# EAGLE design Breakout_v1 (EAGLE 7.5.0)
CNAME: EARS PocketQube Breakout Board; CREVISION: 1.0; DESIGNER: L. Stant
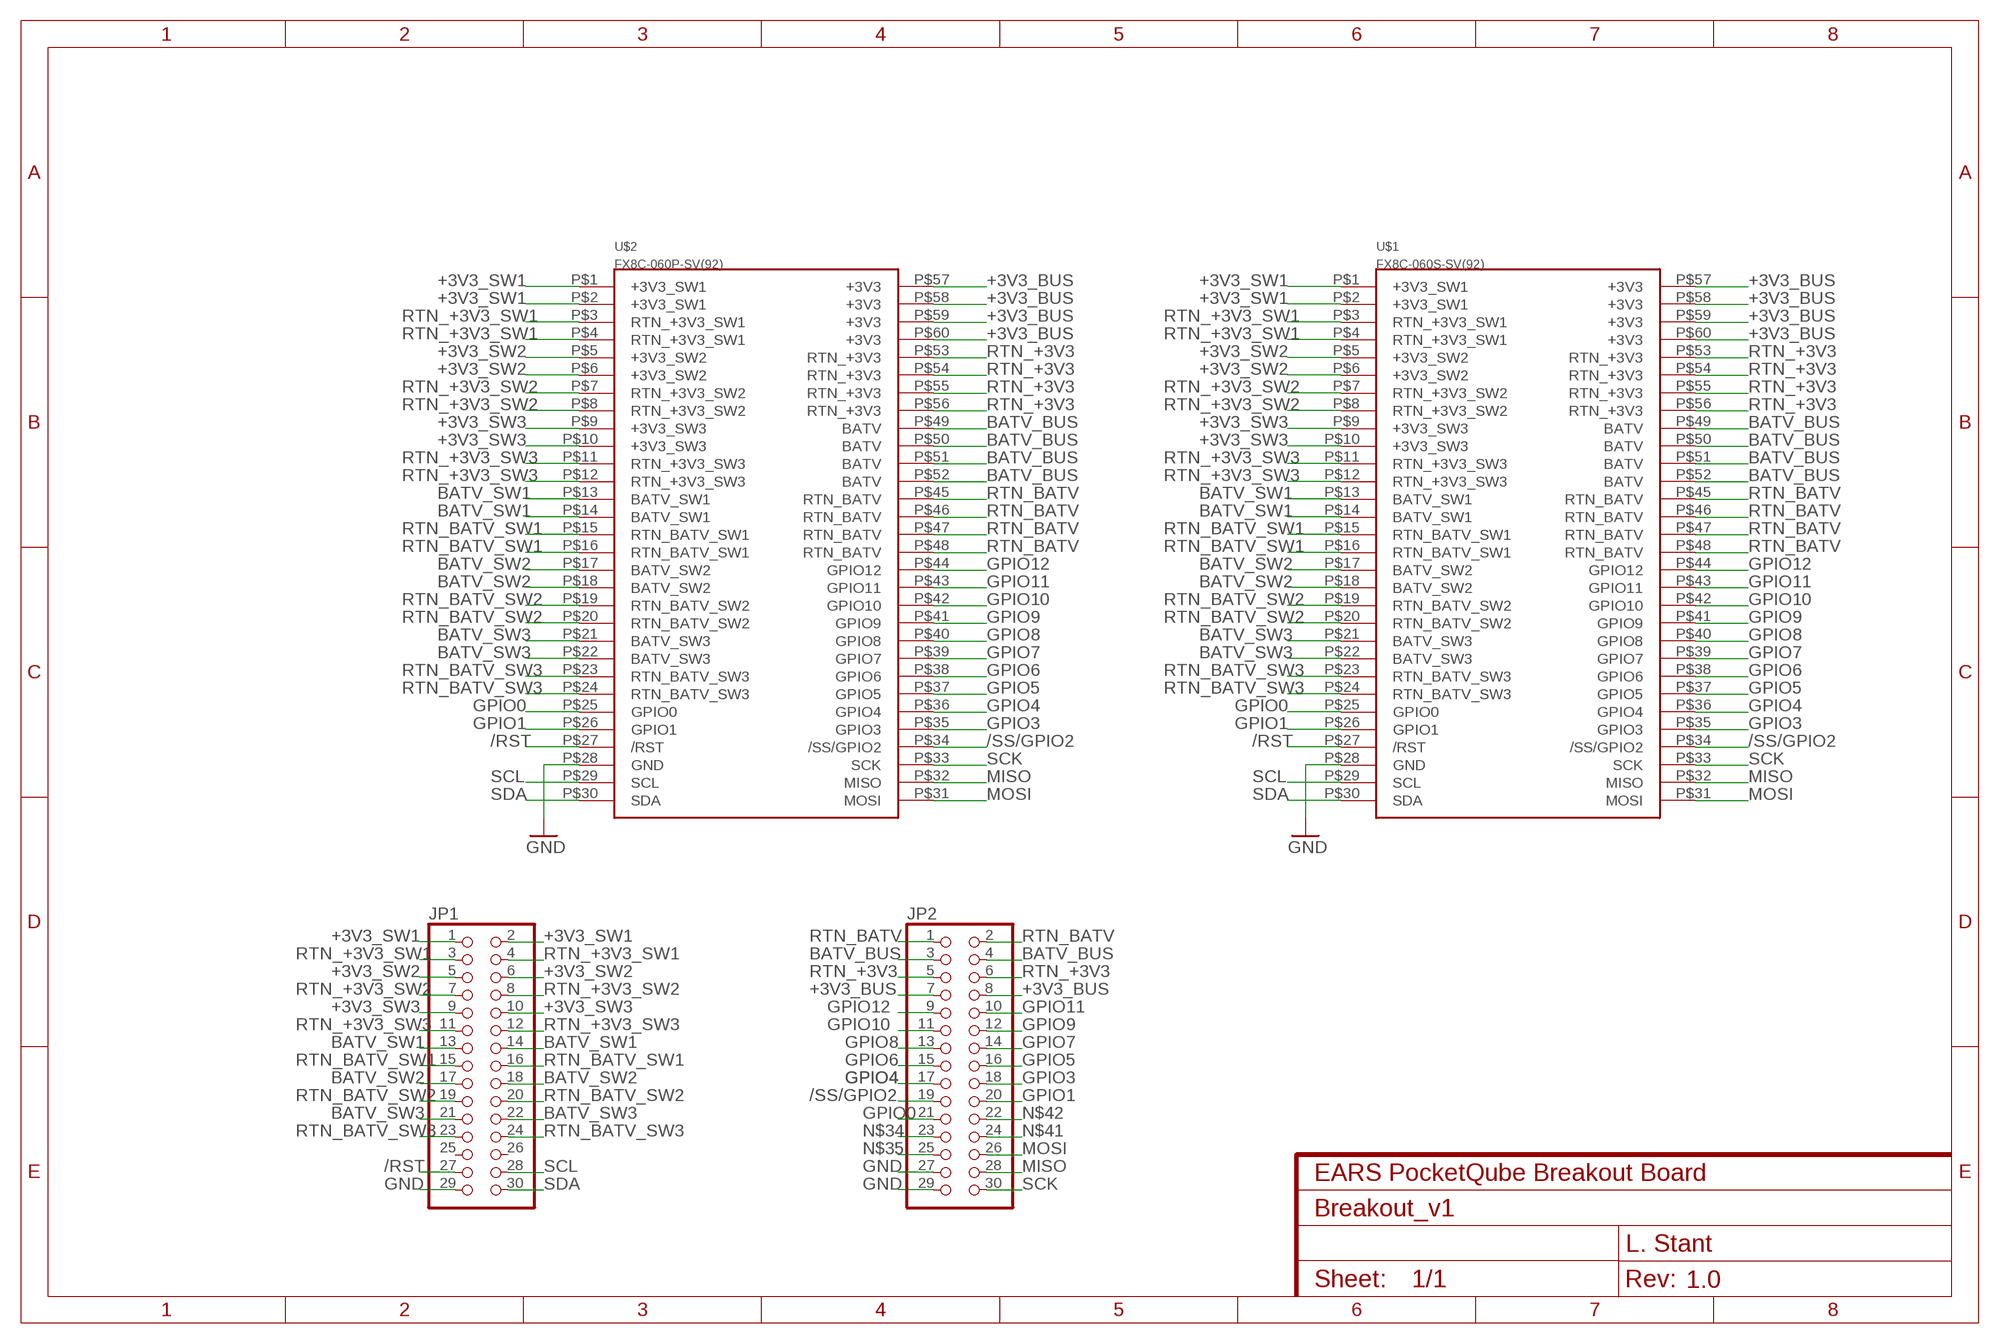
[diagram p0: schematic, sheet 1]

## Parts
JP1  PINHD-2X15  [2X15]
JP2  PINHD-2X15  [2X15]
U$1  FX8C-060S-SV(92)  [FX8C-060S-SV(92)]
U$2  FX8C-060P-SV(92)  [FX8C-060P-SV(92)]

## Nets
+3V3_BUS: JP2.7 JP2.8 U$1.P$57(+3V3) U$1.P$58(+3V3) U$1.P$59(+3V3) U$1.P$60(+3V3) U$2.P$57(+3V3) U$2.P$58(+3V3) U$2.P$59(+3V3) U$2.P$60(+3V3)
+3V3_SW1: JP1.1 JP1.2 U$1.P$1(+3V3_SW1) U$1.P$2(+3V3_SW1) U$2.P$1(+3V3_SW1) U$2.P$2(+3V3_SW1)
+3V3_SW2: JP1.5 JP1.6 U$1.P$5(+3V3_SW2) U$1.P$6(+3V3_SW2) U$2.P$5(+3V3_SW2) U$2.P$6(+3V3_SW2)
+3V3_SW3: JP1.9 JP1.10 U$1.P$9(+3V3_SW3) U$1.P$10(+3V3_SW3) U$2.P$9(+3V3_SW3) U$2.P$10(+3V3_SW3)
/RST: JP1.27 U$1.P$27(/RST) U$2.P$27(/RST)
/SS/GPIO2: JP2.19 U$1.P$34(/SS/GPIO2) U$2.P$34(/SS/GPIO2)
BATV_BUS: JP2.3 JP2.4 U$1.P$49(BATV) U$1.P$50(BATV) U$1.P$51(BATV) U$1.P$52(BATV) U$2.P$49(BATV) U$2.P$50(BATV) U$2.P$51(BATV) U$2.P$52(BATV)
BATV_SW1: JP1.13 JP1.14 U$1.P$13(BATV_SW1) U$1.P$14(BATV_SW1) U$2.P$13(BATV_SW1) U$2.P$14(BATV_SW1)
BATV_SW2: JP1.17 JP1.18 U$1.P$17(BATV_SW2) U$1.P$18(BATV_SW2) U$2.P$17(BATV_SW2) U$2.P$18(BATV_SW2)
BATV_SW3: JP1.21 JP1.22 U$1.P$21(BATV_SW3) U$1.P$22(BATV_SW3) U$2.P$21(BATV_SW3) U$2.P$22(BATV_SW3)
GND: JP1.29 JP2.27 JP2.29 U$1.P$28(GND) U$2.P$28(GND)
GPIO0: JP2.21 U$1.P$25(GPIO0) U$2.P$25(GPIO0)
GPIO1: JP2.20 U$1.P$26(GPIO1) U$2.P$26(GPIO1)
GPIO3: JP2.18 U$1.P$35(GPIO3) U$2.P$35(GPIO3)
GPIO4: JP2.17 U$1.P$36(GPIO4) U$2.P$36(GPIO4)
GPIO5: JP2.16 U$1.P$37(GPIO5) U$2.P$37(GPIO5)
GPIO6: JP2.15 U$1.P$38(GPIO6) U$2.P$38(GPIO6)
GPIO7: JP2.14 U$1.P$39(GPIO7) U$2.P$39(GPIO7)
GPIO8: JP2.13 U$1.P$40(GPIO8) U$2.P$40(GPIO8)
GPIO9: JP2.12 U$1.P$41(GPIO9) U$2.P$41(GPIO9)
GPIO10: JP2.11 U$1.P$42(GPIO10) U$2.P$42(GPIO10)
GPIO11: JP2.10 U$1.P$43(GPIO11) U$2.P$43(GPIO11)
GPIO12: JP2.9 U$1.P$44(GPIO12) U$2.P$44(GPIO12)
MISO: JP2.28 U$1.P$32(MISO) U$2.P$32(MISO)
MOSI: JP2.26 U$1.P$31(MOSI) U$2.P$31(MOSI)
N$34: JP2.23
N$35: JP2.25
N$41: JP2.24
N$42: JP2.22
RTN_+3V3: JP2.5 JP2.6 U$1.P$53(RTN_+3V3) U$1.P$54(RTN_+3V3) U$1.P$55(RTN_+3V3) U$1.P$56(RTN_+3V3) U$2.P$53(RTN_+3V3) U$2.P$54(RTN_+3V3) U$2.P$55(RTN_+3V3) U$2.P$56(RTN_+3V3)
RTN_+3V3_SW1: JP1.3 JP1.4 U$1.P$3(RTN_+3V3_SW1) U$1.P$4(RTN_+3V3_SW1) U$2.P$3(RTN_+3V3_SW1) U$2.P$4(RTN_+3V3_SW1)
RTN_+3V3_SW2: JP1.7 JP1.8 U$1.P$7(RTN_+3V3_SW2) U$1.P$8(RTN_+3V3_SW2) U$2.P$7(RTN_+3V3_SW2) U$2.P$8(RTN_+3V3_SW2)
RTN_+3V3_SW3: JP1.11 JP1.12 U$1.P$11(RTN_+3V3_SW3) U$1.P$12(RTN_+3V3_SW3) U$2.P$11(RTN_+3V3_SW3) U$2.P$12(RTN_+3V3_SW3)
RTN_BATV: JP2.1 JP2.2 U$1.P$45(RTN_BATV) U$1.P$46(RTN_BATV) U$1.P$47(RTN_BATV) U$1.P$48(RTN_BATV) U$2.P$45(RTN_BATV) U$2.P$46(RTN_BATV) U$2.P$47(RTN_BATV) U$2.P$48(RTN_BATV)
RTN_BATV_SW1: JP1.15 JP1.16 U$1.P$15(RTN_BATV_SW1) U$1.P$16(RTN_BATV_SW1) U$2.P$15(RTN_BATV_SW1) U$2.P$16(RTN_BATV_SW1)
RTN_BATV_SW2: JP1.19 JP1.20 U$1.P$19(RTN_BATV_SW2) U$1.P$20(RTN_BATV_SW2) U$2.P$19(RTN_BATV_SW2) U$2.P$20(RTN_BATV_SW2)
RTN_BATV_SW3: JP1.23 JP1.24 U$1.P$23(RTN_BATV_SW3) U$1.P$24(RTN_BATV_SW3) U$2.P$23(RTN_BATV_SW3) U$2.P$24(RTN_BATV_SW3)
SCK: JP2.30 U$1.P$33(SCK) U$2.P$33(SCK)
SCL: JP1.28 U$1.P$29(SCL) U$2.P$29(SCL)
SDA: JP1.30 U$1.P$30(SDA) U$2.P$30(SDA)
Unconnected: JP1.25 JP1.26

## Library data of the parts
JP1 JP2 = pinhead:PINHD-2X15: PIN HEADER
U$1 = Template:FX8C-060S-SV(92)
U$2 = Template:FX8C-060P-SV(92)

## Board
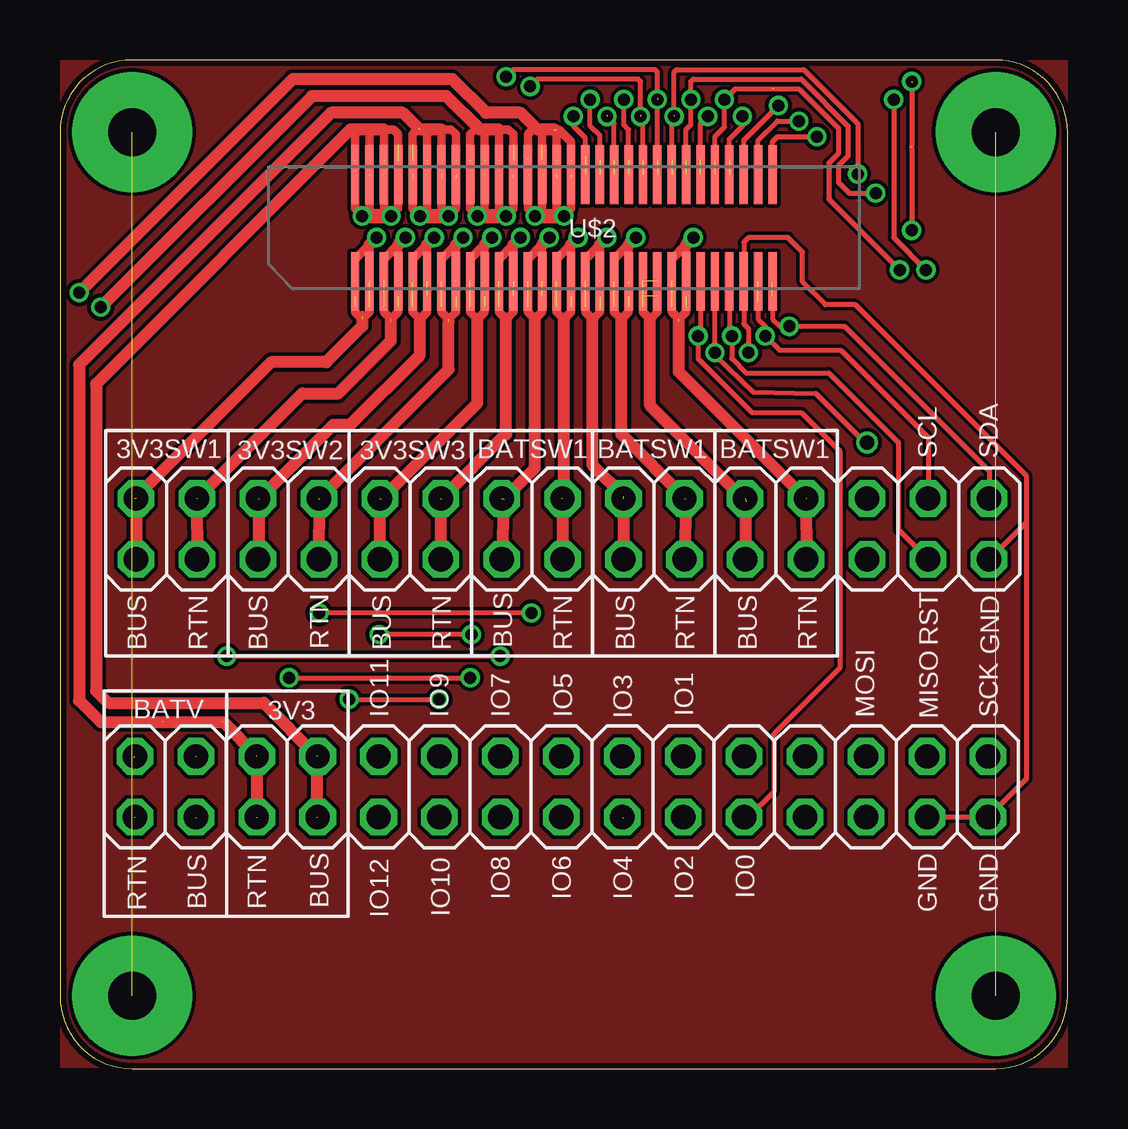
[diagram p1: board, top side]
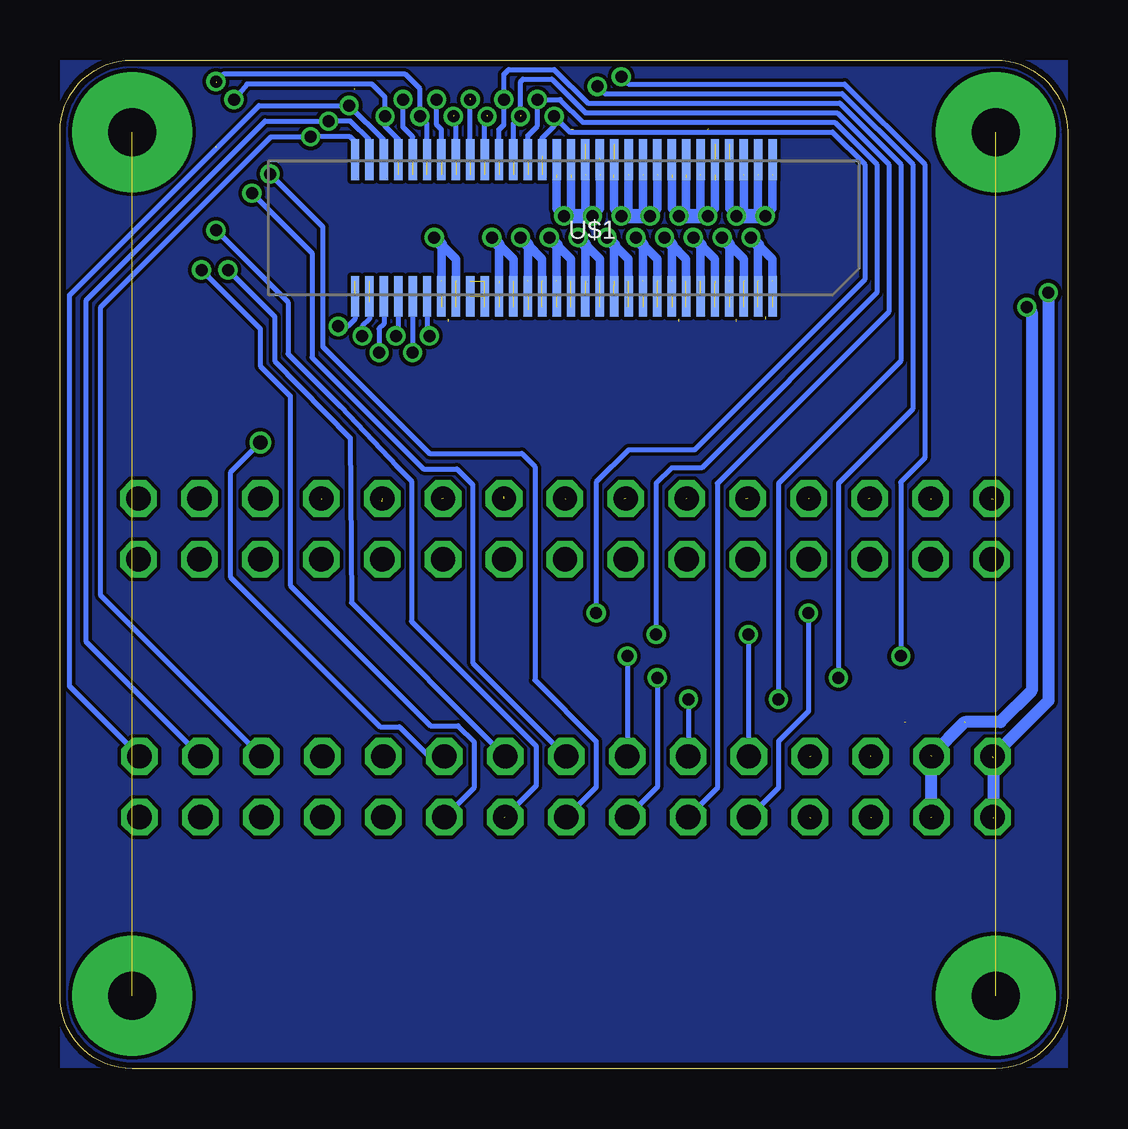
[diagram p2: board, bottom side, seen from below]

Size 42 x 42.05 mm. Coordinates in mm from the lower left corner, seen from the top.
Outline: 3,0 39,0 arc90 42,3.05 42,39.05 arc90 39,42.05 3,42.05 arc90 0,39.05 0,3.05 arc90 3,0
Copper layers (1*16): Top 0.035mm / dielectric 1.5mm / Bottom 0.035mm
Design rules "SeeedStudio_2layer_DRU_no_angle_20140221 *": minimum track width 6mil, minimum drill 0.5mm, track to track 6mil, track to pad 6mil, pad to pad 6mil, via to via 6mil, smd to smd 0mil, copper to edge 10mil, drill to drill 10mil, minimum pad ring 10mil, minimum via ring 6mil, stop-mask expansion 2mil, vias tented up to drill 100mil, thermal gap 10mil

### Footprints (pad centres in the part's own frame; a part is rotated, then mirrored left to right if it is on the bottom)
2X15 = drill 1.016 octagon: 1 -17.78,-1.27; 2 -17.78,1.27; 3 -15.24,-1.27; 4 -15.24,1.27; 5 -12.7,-1.27; 6 -12.7,1.27; 7 -10.16,-1.27; 8 -10.16,1.27; 9 -7.62,-1.27; 10 -7.62,1.27; 11 -5.08,-1.27; 12 -5.08,1.27; 13 -2.54,-1.27; 14 -2.54,1.27; 15 0,-1.27; 16 0,1.27; 17 2.54,-1.27; 18 2.54,1.27; 19 5.08,-1.27; 20 5.08,1.27; 21 7.62,-1.27; 22 7.62,1.27; 23 10.16,-1.27; 24 10.16,1.27; 25 12.7,-1.27; 26 12.7,1.27; 27 15.24,-1.27; 28 15.24,1.27; 29 17.78,-1.27; 30 17.78,1.27
FX8C-060S-SV(92) = smd 0.35 x 1.7: P$1 -8.7,2.85; P$2 -8.1,2.85; P$3 -7.5,2.85; P$4 -6.9,2.85; P$5 -6.3,2.85; P$6 -5.7,2.85; P$7 -5.1,2.85; P$8 -4.5,2.85; P$9 -3.9,2.85; P$10 -3.3,2.85; P$11 -2.7,2.85; P$12 -2.1,2.85; P$13 -1.5,2.85; P$14 -0.9,2.85; P$15 -0.3,2.85; P$16 0.3,2.85; P$17 0.9,2.85; P$18 1.5,2.85; P$19 2.1,2.85; P$20 2.7,2.85; P$21 3.3,2.85; P$22 3.9,2.85; P$23 4.5,2.85; P$24 5.1,2.85; P$25 5.7,2.85; P$26 6.3,2.85; P$27 6.9,2.85; P$28 7.5,2.85; P$29 8.1,2.85; P$30 8.7,2.85; P$31 8.7,-2.85; P$32 8.1,-2.85; P$33 7.5,-2.85; P$34 6.9,-2.85; P$35 6.3,-2.85; P$36 5.7,-2.85; P$37 5.1,-2.85; P$38 4.5,-2.85; P$39 3.9,-2.85; P$40 3.3,-2.85; P$41 2.7,-2.85; P$42 2.1,-2.85; P$43 1.5,-2.85; P$44 0.9,-2.85; P$45 0.3,-2.85; P$46 -0.3,-2.85; P$47 -0.9,-2.85; P$48 -1.5,-2.85; P$49 -2.1,-2.85; P$50 -2.7,-2.85; P$51 -3.3,-2.85; P$52 -3.9,-2.85; P$53 -4.5,-2.85; P$54 -5.1,-2.85; P$55 -5.7,-2.85; P$56 -6.3,-2.85; P$57 -6.9,-2.85; P$58 -7.5,-2.85; P$59 -8.1,-2.85; P$60 -8.7,-2.85
FX8C-060P-SV(92) = smd 0.35 x 2.45: P$1 -8.7,-2.225; P$2 -8.1,-2.225; P$3 -7.5,-2.225; P$4 -6.9,-2.225; P$5 -6.3,-2.225; P$6 -5.7,-2.225; P$7 -5.1,-2.225; P$8 -4.5,-2.225; P$9 -3.9,-2.225; P$10 -3.3,-2.225; P$11 -2.7,-2.225; P$12 -2.1,-2.225; P$13 -1.5,-2.225; P$14 -0.9,-2.225; P$15 -0.3,-2.225; P$16 0.3,-2.225; P$17 0.9,-2.225; P$18 1.5,-2.225; P$19 2.1,-2.225; P$20 2.7,-2.225; P$21 3.3,-2.225; P$22 3.9,-2.225; P$23 4.5,-2.225; P$24 5.1,-2.225; P$25 5.7,-2.225; P$26 6.3,-2.225; P$27 6.9,-2.225; P$28 7.5,-2.225; P$29 8.1,-2.225; P$30 8.7,-2.225; P$31 8.7,2.225; P$32 8.1,2.225; P$33 7.5,2.225; P$34 6.9,2.225; P$35 6.3,2.225; P$36 5.7,2.225; P$37 5.1,2.225; P$38 4.5,2.225; P$39 3.9,2.225; P$40 3.3,2.225; P$41 2.7,2.225; P$42 2.1,2.225; P$43 1.5,2.225; P$44 0.9,2.225; P$45 0.3,2.225; P$46 -0.3,2.225; P$47 -0.9,2.225; P$48 -1.5,2.225; P$49 -2.1,2.225; P$50 -2.7,2.225; P$51 -3.3,2.225; P$52 -3.9,2.225; P$53 -4.5,2.225; P$54 -5.1,2.225; P$55 -5.7,2.225; P$56 -6.3,2.225; P$57 -6.9,2.225; P$58 -7.5,2.225; P$59 -8.1,2.225; P$60 -8.7,2.225

### Placement (x,y rotation side)
JP1  20.95,22.5 0 top
JP2  20.9,11.75 0 top
U$1  21,35.05 180 bottom
U$2  21,35.05 0 top

### Tracks (layer width: path | path; a pad name or v marks a point on that pad's centre or on a via)
+3V3_BUS  (via drill 0.5)  (10 unrouted)
  Top 0.35: U$2.P$57 14.1,35.85 v13.8,35.55 13.5,35.85 13.5,37.25 | 12.9,37.25 12.9,35.85 v12.6,35.55 12.3,35.85 12.3,37.25 | 14.1,38.55 14.1,38.95 13.9,39.15 13.5,39.15 13.5,38.55 | 12.4,39.15 12.3,38.95 12.3,38.55 | 12.9,38.55 12.9,39.15
  Top 0.5: 13.5,39.15 12.9,39.15 12.4,39.15 12.1,39.15 1.5,28.55 1.5,15.75 2,15.25 8.5,15.25 10.7,13.05 10.7,10.45
  Top 0.6: v12.6,35.55 v13.8,35.55
  Bottom 0.35: 12.3,37.85 12.3,35.85 v12.6,35.55 12.9,35.85 12.9,37.85 | 13.5,37.85 13.5,35.85 v13.8,35.55 14.1,35.85 14.1,37.85
  Bottom 0.6: v12.6,35.55 v13.8,35.55
+3V3_SW1  (via drill 0.5)  (7 unrouted)
  Top 0.35: 12.9,33.85 12.9,34.35 12.3,33.75 12.3,32.85 | 12.9,31.75 12.9,31.55 12.6,31.25 12.3,31.55 12.3,31.75
  Top 0.5: 12.9,34.35 v13.2,34.65 | 12.6,31.35 12.6,30.95 11.1,29.45 8.8,29.45 3.1,23.75 | JP1.2 JP1.1
  Bottom 0.35: 12.9,32.85 12.9,34.35 12.3,33.75 12.3,32.85
  Bottom 0.5: 12.9,34.35 v13.2,34.65
+3V3_SW2  (via drill 0.5)  (6 unrouted)
  Top 0.35: 15.3,33.85 15.3,34.35 14.7,33.75 | 15.3,31.65 15.3,31.55 15,31.25 14.7,31.55 14.7,31.75
  Top 0.5: 15.3,34.35 v15.6,34.65 | 15,31.25 15,29.75 12.1,26.85 11.4,26.85 8.3,23.75 JP1.5
  Bottom 0.35: 15.3,32.75 15.3,34.35 14.7,33.75 14.7,32.75
  Bottom 0.5: v15.6,34.65 15.3,34.35
+3V3_SW3  (via drill 0.5)  (6 unrouted)
  Top 0.35: 17.7,33.85 17.7,34.35 17.1,33.75 | 17.7,31.75 17.7,31.55 17.4,31.25 17.1,31.55 17.1,31.75
  Top 0.5: 17.7,34.35 v18,34.65 | 13.4,23.75 17.4,27.75 17.4,31.25 | JP1.10 JP1.9
  Bottom 0.35: 17.7,32.85 17.7,34.35 17.1,33.75 17.1,32.85
  Bottom 0.5: v18,34.65 17.7,34.35
/RST  (via drill 0.5)
  Top 0.2: U$2.P$27 27.9,30.65 v28,30.55 28,29.6 28.6,29 32.05,29 34.95,26.1 34.95,22.47 JP1.27
  Bottom 0.2: U$1.P$27 27.9,30.65 v28,30.55
/SS/GPIO2  (via drill 0.5)  (1 unrouted)
  Top 0.2: 27.9,38.25 27.9,38.75 28.45,39.3 v28.45,39.7 | v34.75,40.4 34.75,34.65 v36.1,33.3
  Bottom 0.2: U$1.P$34 27.9,38.75 28.45,39.3 v28.45,39.7 28.45,40.5 29,41.05 34.2,41.05 v34.75,40.4 | v36.1,33.3 33.65,30.85 33.65,29.3 32.4,28.05 32.4,20.15 26.55,14.3 25.4,14.3 24.75,13.65 24.75,11.7 JP2.19
BATV_BUS  (via drill 0.5)  (12 unrouted)
  Top 0.35: 17.1,37.25 17.1,35.85 v17.4,35.55 17.7,35.85 17.7,37.25 | 18.3,37.25 18.3,35.85 v18.6,35.55 18.9,35.85 18.9,37.15 | 18.9,38.55 18.9,38.95 18.7,39.15 18.3,39.15 18.3,38.55 | 17.1,38.55 17.1,38.95 17.3,39.15 17.5,39.15 | 17.7,38.55 17.7,39.15
  Top 0.5: 18.3,39.15 17.7,39.15 17.5,39.15 16.1,40.55 10.5,40.55 v1.7,31.75
  Top 0.6: v17.4,35.55 v18.6,35.55
  Bottom 0.35: 17.1,37.85 17.1,35.85 v17.4,35.55 17.7,35.85 17.7,37.85 | 18.3,37.85 18.3,35.85 v18.6,35.55 18.9,35.85 18.9,37.85
  Bottom 0.5: 4.27,14.45 2.8,14.45 1.5,15.75 1.5,31.55 v1.7,31.75 | 4.3,14.45 5.7,13.05 5.7,10.45
  Bottom 0.6: v17.4,35.55 v18.6,35.55
BATV_SW1  (via drill 0.5)  (6 unrouted)
  Top 0.35: 20.1,33.85 20.1,34.35 19.5,33.75 | 20.1,31.65 20.1,31.55 19.8,31.25 19.5,31.55 19.5,31.75
  Top 0.5: v20.4,34.65 20.1,34.35 | 19.8,31.25 19.8,25.05 18.5,23.75 JP1.13
  Bottom 0.35: 20.1,32.75 20.1,34.35 19.5,33.75 19.5,32.65
  Bottom 0.5: v20.4,34.65 20.1,34.35
BATV_SW2  (via drill 0.5)  (6 unrouted)
  Top 0.35: 22.5,33.85 22.5,34.35 21.9,33.75 | 22.5,31.65 22.5,31.55 22.2,31.25 21.9,31.55 21.9,31.75
  Top 0.5: v22.8,34.65 22.5,34.35 | 23.5,23.85 22.2,25.15 22.2,31.25 | JP1.18 JP1.17
  Bottom 0.35: 22.5,32.85 22.5,34.35 21.9,33.75 21.9,32.85
  Bottom 0.5: v22.8,34.65 22.5,34.35
BATV_SW3  (5 unrouted)
  Top 0.35: 24.9,31.55 24.6,31.25 24.3,31.55 24.3,31.75
  Top 0.5: 28.6,23.65 24.6,27.65 24.6,31.25 | JP1.22 JP1.21
BOARD
  pour Bottom: 0,42.05 42,42.05 42,0.05 0,0.05
  pour Top: 0,42.05 42,42.05 42,0.05 0,0.05
CHASSIS_GND  (via drill 2 pad 5)  (1 unrouted)
  other vias: 39,39.05 39,3.05
GND  (via drill 0.5)
  Top 0.2: v28.7,29.85 28.7,30.85 28.5,31.05 U$2.P$28 28.5,34.45 28.7,34.65 30.35,34.65 30.95,34.05 30.95,32.8 31.9,31.85 33.15,31.85 40.3,24.7 40.3,22.8 | JP1.29 40.3,22.8 | 40.3,22.8 40.3,12.1 JP2.29 JP2.27
  Bottom 0.2: U$1.P$28 28.5,31.05 28.7,30.85 v28.7,29.85
GPIO0  (via drill 0.5)
  Top 0.2: U$2.P$25 26.7,30.65 v26.6,30.55 26.6,29.6 28.85,27.35 30.9,27.35 32.5,25.75 32.5,16.7 29.75,13.95 29.75,11.55 28.68,10.48 JP2.21
  Bottom 0.2: U$1.P$25 26.7,30.65 v26.6,30.55
GPIO1  (via drill 0.5, 0.6)
  Top 0.2: U$2.P$26 v27.3,29.85 27.3,29.75 28.9,28.2 31.5,28.15 33.55,26.1 v33.65,26.1
  Bottom 0.2: U$1.P$26 v27.3,29.85 | v33.65,26.1 34.9,24.85 34.9,20.5 28.65,14.25 27.85,14.25 26.62,13.02 JP2.20
GPIO3  (via drill 0.5)  (2 unrouted)
  Top 0.2: 27.3,38.15 27.3,38.85 27.7,39.25 v27.7,40.4 28.15,40.85 29.7,40.85 | 29.75,40.85 30.8,40.85 32.45,39.2 32.45,38.15 32.05,37.75 32.05,36.25 v35,33.3
  Bottom 0.2: U$1.P$35 27.3,38.85 27.7,39.25 v27.7,40.4 | v35,33.3 33.05,31.35 33.05,29.5 29.9,26.3 29.85,19.43 JP2.18
GPIO4  (via drill 0.5)  (4 unrouted)
  Top 0.2: 26.7,38.15 26.7,39.4 v27,39.7 | 35.5,41.1 35.5,38.45 | 35.5,38.4 v35.5,34.95
  Bottom 0.2: U$1.P$36 26.7,39.4 v27,39.7 27,40.85 27.6,41.45 35.2,41.45 v35.5,41.15 | v35.5,34.95 32.5,31.95 32.5,29.8 30.3,27.6 27.95,25.1 27.35,24.5 27.35,18.65 22.15,13.45 22.15,11.8 23.5,10.45
GPIO5  (via drill 0.5)  (1 unrouted)
  Top 0.2: 26.1,38.25 26.1,39.15 26.3,39.35 v26.3,40.4 26.3,41.15 26.4,41.25 30.9,41.25 32.85,39.3 32.85,38.05 32.45,37.65 32.45,36.95 32.9,36.5 v34,36.5
  Bottom 0.2: U$1.P$37 26.1,39.15 26.3,39.35 v26.3,40.4 | v34,36.5 31.5,34 31.5,29.65 26.85,25 25.45,25 24.8,24.35 24.8,16.92 JP2.16
GPIO6  (via drill 0.5)  (2 unrouted)
  Top 0.2: 25.5,38.25 25.5,39.6 v25.6,39.7 | 25.6,39.75 25.6,41.55 25.7,41.65 31,41.65 33.25,39.4 v33.25,37.3
  Bottom 0.2: U$1.P$38 25.5,39.6 v25.6,39.7 | v33.25,37.3 31.05,35.1 31.05,30.1 26.6,25.65 22.75,25.65 22.2,25.1 22.2,16.2 19.65,13.65 19.65,11.73 JP2.15
GPIO7  (via drill 0.5)  (2 unrouted)
  Top 0.2: 24.9,38.25 v24.9,40.4 | 24.9,40.45 24.9,41.55 24.8,41.65 18.9,41.65 v18.6,41.35 | v6.95,17.2 v18.35,17.2
  Bottom 0.2: U$1.P$39 v24.9,40.4 | v18.6,41.35 18.3,41.05 9.3,41.05 5.95,37.7 5.95,25.45 6.95,24.45 v6.95,17.2 | v18.35,17.2 JP2.14
GPIO8  (via drill 0.5)  (2 unrouted)
  Top 0.2: 24.3,38.15 24.3,39.6 v24.2,39.7 | 24.2,39.75 24.2,41.15 24.1,41.25 19.9,41.25 v19.6,40.95 | v9.55,16.3 v17.1,16.3
  Bottom 0.2: U$1.P$40 24.3,39.6 v24.2,39.7 | v19.6,40.95 19.3,40.65 9.4,40.65 6.45,37.7 6.45,27.5 9.55,24.4 v9.55,16.3 | v17.1,16.3 17.1,11.74 JP2.13
GPIO9  (via drill 0.5)  (1 unrouted)
  Top 0.2: 23.7,38.35 23.7,39.15 23.5,39.35 v23.5,40.4 | v12.05,15.4 v15.8,15.4
  Bottom 0.2: U$1.P$41 23.7,39.15 23.5,39.35 v23.5,40.4 23.5,41.45 23.3,41.65 21.4,41.65 20,40.25 9.5,40.25 6.95,37.7 6.95,29.5 12.05,24.4 v12.05,15.4 | v15.8,15.4 15.8,13.04 JP2.12
GPIO10  (via drill 0.5)  (2 unrouted)
  Top 0.2: 23.1,38.15 23.1,39.4 v22.8,39.7
  Bottom 0.2: U$1.P$42 23.1,39.4 v22.8,39.7 | 22.8,39.75 22.8,41.15 22.7,41.25 21.5,41.25 20.1,39.85 9.6,39.85 7.45,37.7 7.45,31.55 14.6,24.4 14.6,11.7 JP2.11
GPIO11  (via drill 0.5)  (1 unrouted)
  Top 0.2: 22.5,38.35 22.5,38.9 22.1,39.3 v22.1,40.4 | v17.15,18.1 v13.3,18.1
  Bottom 0.2: U$1.P$43 22.5,38.9 22.1,39.3 v22.1,40.4 21.15,40.4 20.2,39.45 9.7,39.45 7.95,37.7 7.95,32.35 15.25,25.05 16.5,25.05 17.15,24.4 v17.15,18.1 | v13.3,18.1 13.3,13.04 JP2.10
GPIO12  (via drill 0.5)  (2 unrouted)
  Top 0.2: 21.9,38.05 21.9,38.8 21.4,39.3 v21.4,39.7 | v19.65,19 v10.8,19
  Bottom 0.2: 21.9,38.5 21.9,38.8 21.4,39.3 v21.4,39.7 20.75,39.05 9.8,39.05 8.45,37.7 8.45,32.9 15.55,25.8 18.3,25.8 19.65,24.45 v19.65,19 | v10.8,19 10.8,14.9 12.05,13.65 12.05,11.71 JP2.9
MISO  (via drill 0.5)
  Top 0.2: U$2.P$32 29.1,38.7 29.9,39.5 v30.8,39.5
  Bottom 0.2: U$1.P$32 29.1,38.7 29.9,39.5 v30.8,39.5 33.45,39.5 40.9,32.05 40.9,17.78 JP2.28
MOSI  (via drill 0.5)
  Top 0.2: U$2.P$31 29.7,38.65 29.9,38.85 v31.55,38.85
  Bottom 0.2: U$1.P$31 29.7,38.65 29.9,38.85 v31.55,38.85 33.2,38.85 40.3,31.75 40.3,19.72 JP2.26
N$24  (via drill 2 pad 5)  (1 unrouted)
  other vias: 3,39.05 3,3.05
RTN_+3V3  (via drill 0.5)  (13 unrouted)
  Top 0.35: 14.7,37.05 14.7,35.85 v15,35.55 15.3,35.85 15.3,37.25 | 15.9,37.15 15.9,35.85 v16.2,35.55 16.5,35.85 16.5,37.15 | 16.5,38.55 16.5,38.95 16.3,39.15 15.9,39.15 15.9,38.55 | 14.7,38.55 14.7,38.95 14.94,39.18 14.97,39.18 | 15.3,38.55 15.3,39.15
  Top 0.5: 15.9,39.15 15.3,39.15 15,39.15 14.3,39.85 11.3,39.85 0.8,29.35 0.8,15.35 1.7,14.45 6.75,14.45 | 6.8,14.45 8.2,13.05 8.2,10.45
  Top 0.6: v15,35.55 v16.2,35.55
  Bottom 0.35: 14.7,37.85 14.7,35.85 v15,35.55 15.3,35.85 15.3,37.85 | 15.9,37.85 15.9,35.85 v16.2,35.55 16.5,35.85 16.5,37.85
  Bottom 0.6: v15,35.55 v16.2,35.55
RTN_+3V3_SW1  (via drill 0.5)  (7 unrouted)
  Top 0.35: 14.1,33.95 14.1,34.35 13.5,33.75 | 14.1,31.75 14.1,31.55 13.8,31.25 13.5,31.55 13.5,31.75
  Top 0.5: v14.4,34.65 14.1,34.35 | 13.8,31.15 13.8,30.35 11.6,28.15 10.1,28.15 5.7,23.75 JP1.3
  Bottom 0.35: 14.1,32.85 14.1,34.35 13.5,33.75 13.5,32.85
  Bottom 0.5: v14.4,34.65 14.1,34.35
RTN_+3V3_SW2  (via drill 0.5)  (7 unrouted)
  Top 0.35: 16.5,33.85 16.5,34.35 15.9,33.75 | 16.5,31.75 16.5,31.55 16.2,31.25 15.9,31.55 15.9,31.75
  Top 0.5: 16.5,34.35 v16.8,34.65 | 16.2,31.15 16.2,29.15 10.8,23.75 JP1.7
  Bottom 0.35: 16.5,32.85 16.5,34.35 15.9,33.75 15.9,32.75
  Bottom 0.5: v16.8,34.65 16.5,34.35
RTN_+3V3_SW3  (via drill 0.5)  (6 unrouted)
  Top 0.35: 18.9,33.85 18.9,34.35 18.3,33.75 | 18.9,31.65 18.9,31.55 18.6,31.25 18.3,31.55 18.3,31.75
  Top 0.5: v19.2,34.65 18.9,34.35 | 15.9,23.75 18.6,26.45 18.6,31.25 | JP1.12 JP1.11
  Bottom 0.35: 18.9,32.65 18.9,34.35 18.3,33.75 18.3,32.75
  Bottom 0.5: v19.2,34.65 18.9,34.35
RTN_BATV  (via drill 0.5)  (12 unrouted)
  Top 0.35: 19.5,37.25 19.5,35.85 v19.8,35.55 20.1,35.85 20.1,37.25 | 20.7,37.15 20.7,35.85 v21,35.55 21.3,35.85 21.3,37.15 | 21.3,38.55 21.3,38.65 20.8,39.15 20.7,39.15 20.7,38.55 | 19.5,38.55 19.5,38.95 19.8,39.25 | 20.1,38.55 20.1,39.15
  Top 0.5: 20.6,39.15 20.1,39.15 19.9,39.15 19.8,39.25 19.2,39.85 17.75,39.85 16.35,41.25 9.7,41.25 v0.8,32.35
  Top 0.6: v19.8,35.55 v21,35.55
  Bottom 0.35: 19.5,37.95 19.5,35.85 v19.8,35.55 20.1,35.85 20.1,37.95 | 20.7,37.85 20.7,35.85 v21,35.55 21.3,35.85 21.3,37.85
  Bottom 0.5: v0.8,32.35 0.8,15.34 JP2.2 | 3.1,12.95 3.1,10.45
  Bottom 0.6: v19.8,35.55 v21,35.55
RTN_BATV_SW1  (via drill 0.5)  (6 unrouted)
  Top 0.35: 21.3,33.95 21.3,34.35 20.7,33.75 | 21.3,31.75 21.3,31.55 21,31.25 20.7,31.55 20.7,31.75 | 20.9,23.75 21,23.85
  Top 0.5: v21.6,34.65 21.3,34.35 | 21,23.85 21,31.25 | JP1.16 JP1.15
  Bottom 0.35: 21.3,32.85 21.3,34.35 20.7,33.75 20.7,32.75
  Bottom 0.5: v21.6,34.65 21.3,34.35
RTN_BATV_SW2  (via drill 0.5)  (6 unrouted)
  Top 0.35: 23.7,33.85 23.7,34.35 23.1,33.75 | 23.7,31.75 23.7,31.55 23.4,31.25 23.1,31.55 23.1,31.75
  Top 0.5: v24,34.65 23.7,34.35 | 23.4,31.25 23.4,26.45 26.1,23.75 JP1.19
  Bottom 0.35: 23.7,32.75 23.7,34.35 23.1,33.75 23.1,32.75
  Bottom 0.5: v24,34.65 23.7,34.35
RTN_BATV_SW3  (via drill 0.5)  (7 unrouted)
  Top 0.35: 26.1,33.85 26.1,34.35 25.5,33.75 | 26.1,31.75 26.1,31.55 25.8,31.25 25.5,31.55 25.5,31.75
  Top 0.5: v26.4,34.65 26.1,34.35 | 25.8,31.15 25.8,29.05 31.1,23.75 JP1.23
  Bottom 0.35: 26.1,32.85 26.1,34.35 25.5,33.75 25.5,32.85
  Bottom 0.5: v26.4,34.65 26.1,34.35
SCK  (via drill 0.5)
  Top 0.2: U$2.P$33 28.5,38.7 v29.95,40.15
  Bottom 0.2: U$1.P$33 28.5,38.7 v29.95,40.15 33.7,40.15 41.6,32.25 41.6,15.94 JP2.30
SCL  (via drill 0.5)  (2 unrouted)
  Top 0.2: 29.1,31.75 29.1,31.25 29.4,30.95 v29.4,30.55 30,29.95 32.55,29.95 36.19,26.31 JP1.28
  Bottom 0.2: 29.1,31.95 29.1,31.25 29.4,30.95 v29.4,30.55
SDA  (via drill 0.5)  (2 unrouted)
  Top 0.2: 29.7,31.75 29.7,31.25 30,30.95 v30.4,30.95 32.7,30.95 38.73,24.92 JP1.30
  Bottom 0.2: 29.7,32.25 29.7,31.25 30,30.95 v30.4,30.95

### Text on the board
tNames: 3V3SW1 | 3V3SW2 | 3V3SW3 | BATSW1 | BATSW1 | BATSW1 | SCL | SDA | BUS | RTN | BUS | RTN | BUS | RTN | BUS | RTN | BUS | RTN | BUS | RTN | GND | RST | BATV | 3V3 | IO11 | IO9 | IO7 | IO5 | IO3 | IO1 | MOSI | MISO | SCK | RTN | BUS | RTN | BUS | GND | GND | IO8 | IO6 | IO4 | IO2 | IO0 | IO12 | IO10
tDocu: SurreyEARS Pocketqube | Breakout Board | V0.1